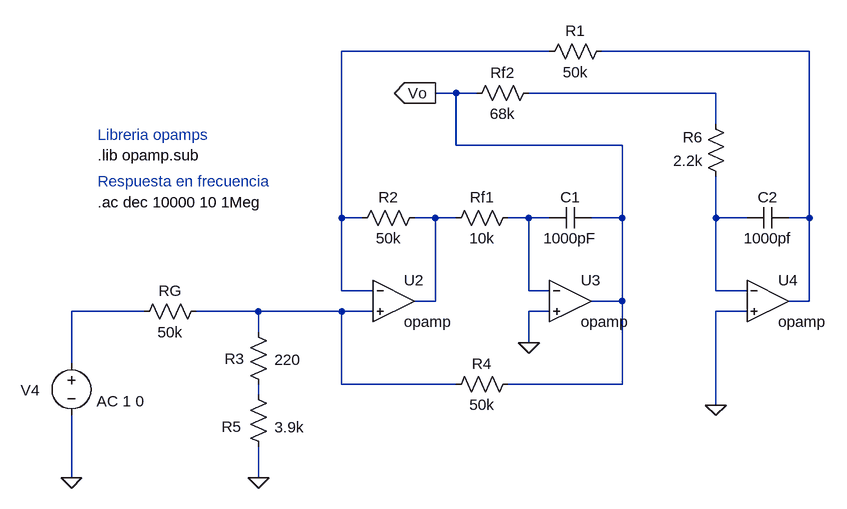
[diagram p0: schematic simulacion_circuito_labo.asc]
simulacion_circuito_labo.asc, the LTspice schematic file:
Version 4
SHEET 1 880 1280
WIRE -176 528 -496 528
WIRE 224 528 -96 528
WIRE -320 592 -352 592
WIRE -288 592 -320 592
WIRE 80 592 -208 592
WIRE 80 640 80 592
WIRE -320 672 -320 592
WIRE -64 672 -320 672
WIRE -496 784 -496 528
WIRE -464 784 -496 784
WIRE -352 784 -384 784
WIRE -320 784 -352 784
WIRE -208 784 -240 784
WIRE -176 784 -208 784
WIRE -64 784 -64 672
WIRE -64 784 -112 784
WIRE 80 784 80 720
WIRE 128 784 80 784
WIRE 224 784 224 528
WIRE 224 784 192 784
WIRE -496 896 -496 784
WIRE -448 896 -496 896
WIRE -208 896 -208 784
WIRE -176 896 -208 896
WIRE 80 896 80 784
WIRE 128 896 80 896
WIRE -352 912 -352 784
WIRE -352 912 -384 912
WIRE -64 912 -64 784
WIRE -64 912 -112 912
WIRE 224 912 224 784
WIRE 224 912 192 912
WIRE -800 928 -912 928
WIRE -624 928 -720 928
WIRE -496 928 -624 928
WIRE -448 928 -496 928
WIRE -176 928 -208 928
WIRE 128 928 80 928
WIRE -624 960 -624 928
WIRE -208 976 -208 928
WIRE -912 1008 -912 928
WIRE -496 1040 -496 928
WIRE -320 1040 -496 1040
WIRE -64 1040 -64 912
WIRE -64 1040 -240 1040
WIRE -624 1056 -624 1040
WIRE 80 1072 80 928
WIRE -912 1184 -912 1088
WIRE -624 1184 -624 1136
FLAG 80 1072 0
FLAG -352 592 Vo
IOPIN -352 592 Out
FLAG -624 1184 0
FLAG -912 1184 0
FLAG -208 976 0
SYMBOL OpAmps\\opamp -416 848 R0
SYMATTR InstName U2
SYMBOL OpAmps\\opamp -144 848 R0
SYMATTR InstName U3
SYMBOL OpAmps\\opamp 160 848 R0
SYMATTR InstName U4
SYMBOL res -704 912 R90
WINDOW 0 0 56 VBottom 2
WINDOW 3 32 56 VTop 2
SYMATTR InstName RG
SYMATTR Value 50k
SYMBOL res -224 1024 R90
WINDOW 0 0 56 VBottom 2
WINDOW 3 32 56 VTop 2
SYMATTR InstName R4
SYMATTR Value 50k
SYMBOL res -368 768 R90
WINDOW 0 0 56 VBottom 2
WINDOW 3 32 56 VTop 2
SYMATTR InstName R2
SYMATTR Value 50k
SYMBOL res -80 512 R90
WINDOW 0 0 56 VBottom 2
WINDOW 3 32 56 VTop 2
SYMATTR InstName R1
SYMATTR Value 50k
SYMBOL cap -112 768 R90
WINDOW 0 0 32 VBottom 2
WINDOW 3 32 32 VTop 2
SYMATTR InstName C1
SYMATTR Value 1000pF
SYMBOL cap 192 768 R90
WINDOW 0 0 32 VBottom 2
WINDOW 3 32 32 VTop 2
SYMATTR InstName C2
SYMATTR Value 1000pf
SYMBOL res -224 768 R90
WINDOW 0 0 56 VBottom 2
WINDOW 3 32 56 VTop 2
SYMATTR InstName Rf1
SYMATTR Value 10k
SYMBOL res -304 608 R270
WINDOW 0 32 56 VTop 2
WINDOW 3 0 56 VBottom 2
SYMATTR InstName Rf2
SYMATTR Value 68k
SYMBOL voltage -912 992 R0
WINDOW 123 39 74 Left 2
WINDOW 39 0 0 Left 0
WINDOW 0 -78 57 Left 2
SYMATTR Value2 AC 1 0
SYMATTR InstName V4
SYMATTR Value ""
SYMBOL res -640 944 R0
WINDOW 0 -36 57 Left 2
WINDOW 3 41 58 Left 2
SYMATTR InstName R3
SYMATTR Value 220
SYMBOL res -640 1040 R0
WINDOW 0 -41 65 Left 2
WINDOW 3 41 66 Left 2
SYMATTR InstName R5
SYMATTR Value 3.9k
SYMBOL res 96 736 R180
WINDOW 0 36 76 Left 2
WINDOW 3 36 40 Left 2
SYMATTR InstName R6
SYMATTR Value 2.2k
TEXT -872 688 Left 2 !.lib opamp.sub
TEXT -872 760 Left 2 !.ac dec 10000 10 1Meg
TEXT -872 656 Left 2 ;Libreria opamps
TEXT -872 728 Left 2 ;Respuesta en frecuencia

The netlist it stands for:
* simulacion_circuito_labo.asc
XU2 N001 N008 N004 opamp Aol=100K GBW=10Meg  ; pins invin noninvin out
XU3 N005 0 Vo opamp Aol=100K GBW=10Meg  ; pins invin noninvin out
XU4 N006 0 N002 opamp Aol=100K GBW=10Meg  ; pins invin noninvin out
RG N008 N007 50k
R4 Vo N008 50k
R2 N004 N001 50k
R1 N002 N001 50k
C1 Vo N005 1000pF
C2 N002 N006 1000pf
Rf1 N005 N004 10k
Rf2 Vo N003 68k
V4 N007 0 AC 1 0
R3 N008 N009 220
R5 N009 0 3.9k
R6 N006 N003 2.2k
.lib opamp.sub
.ac dec 10000 10 1Meg
* Libreria opamps
* Respuesta en frecuencia
.backanno
.end